# Altium schematic sheet Schematic.SchDoc
size A3; SheetNumber: 1; SheetTotal: 1
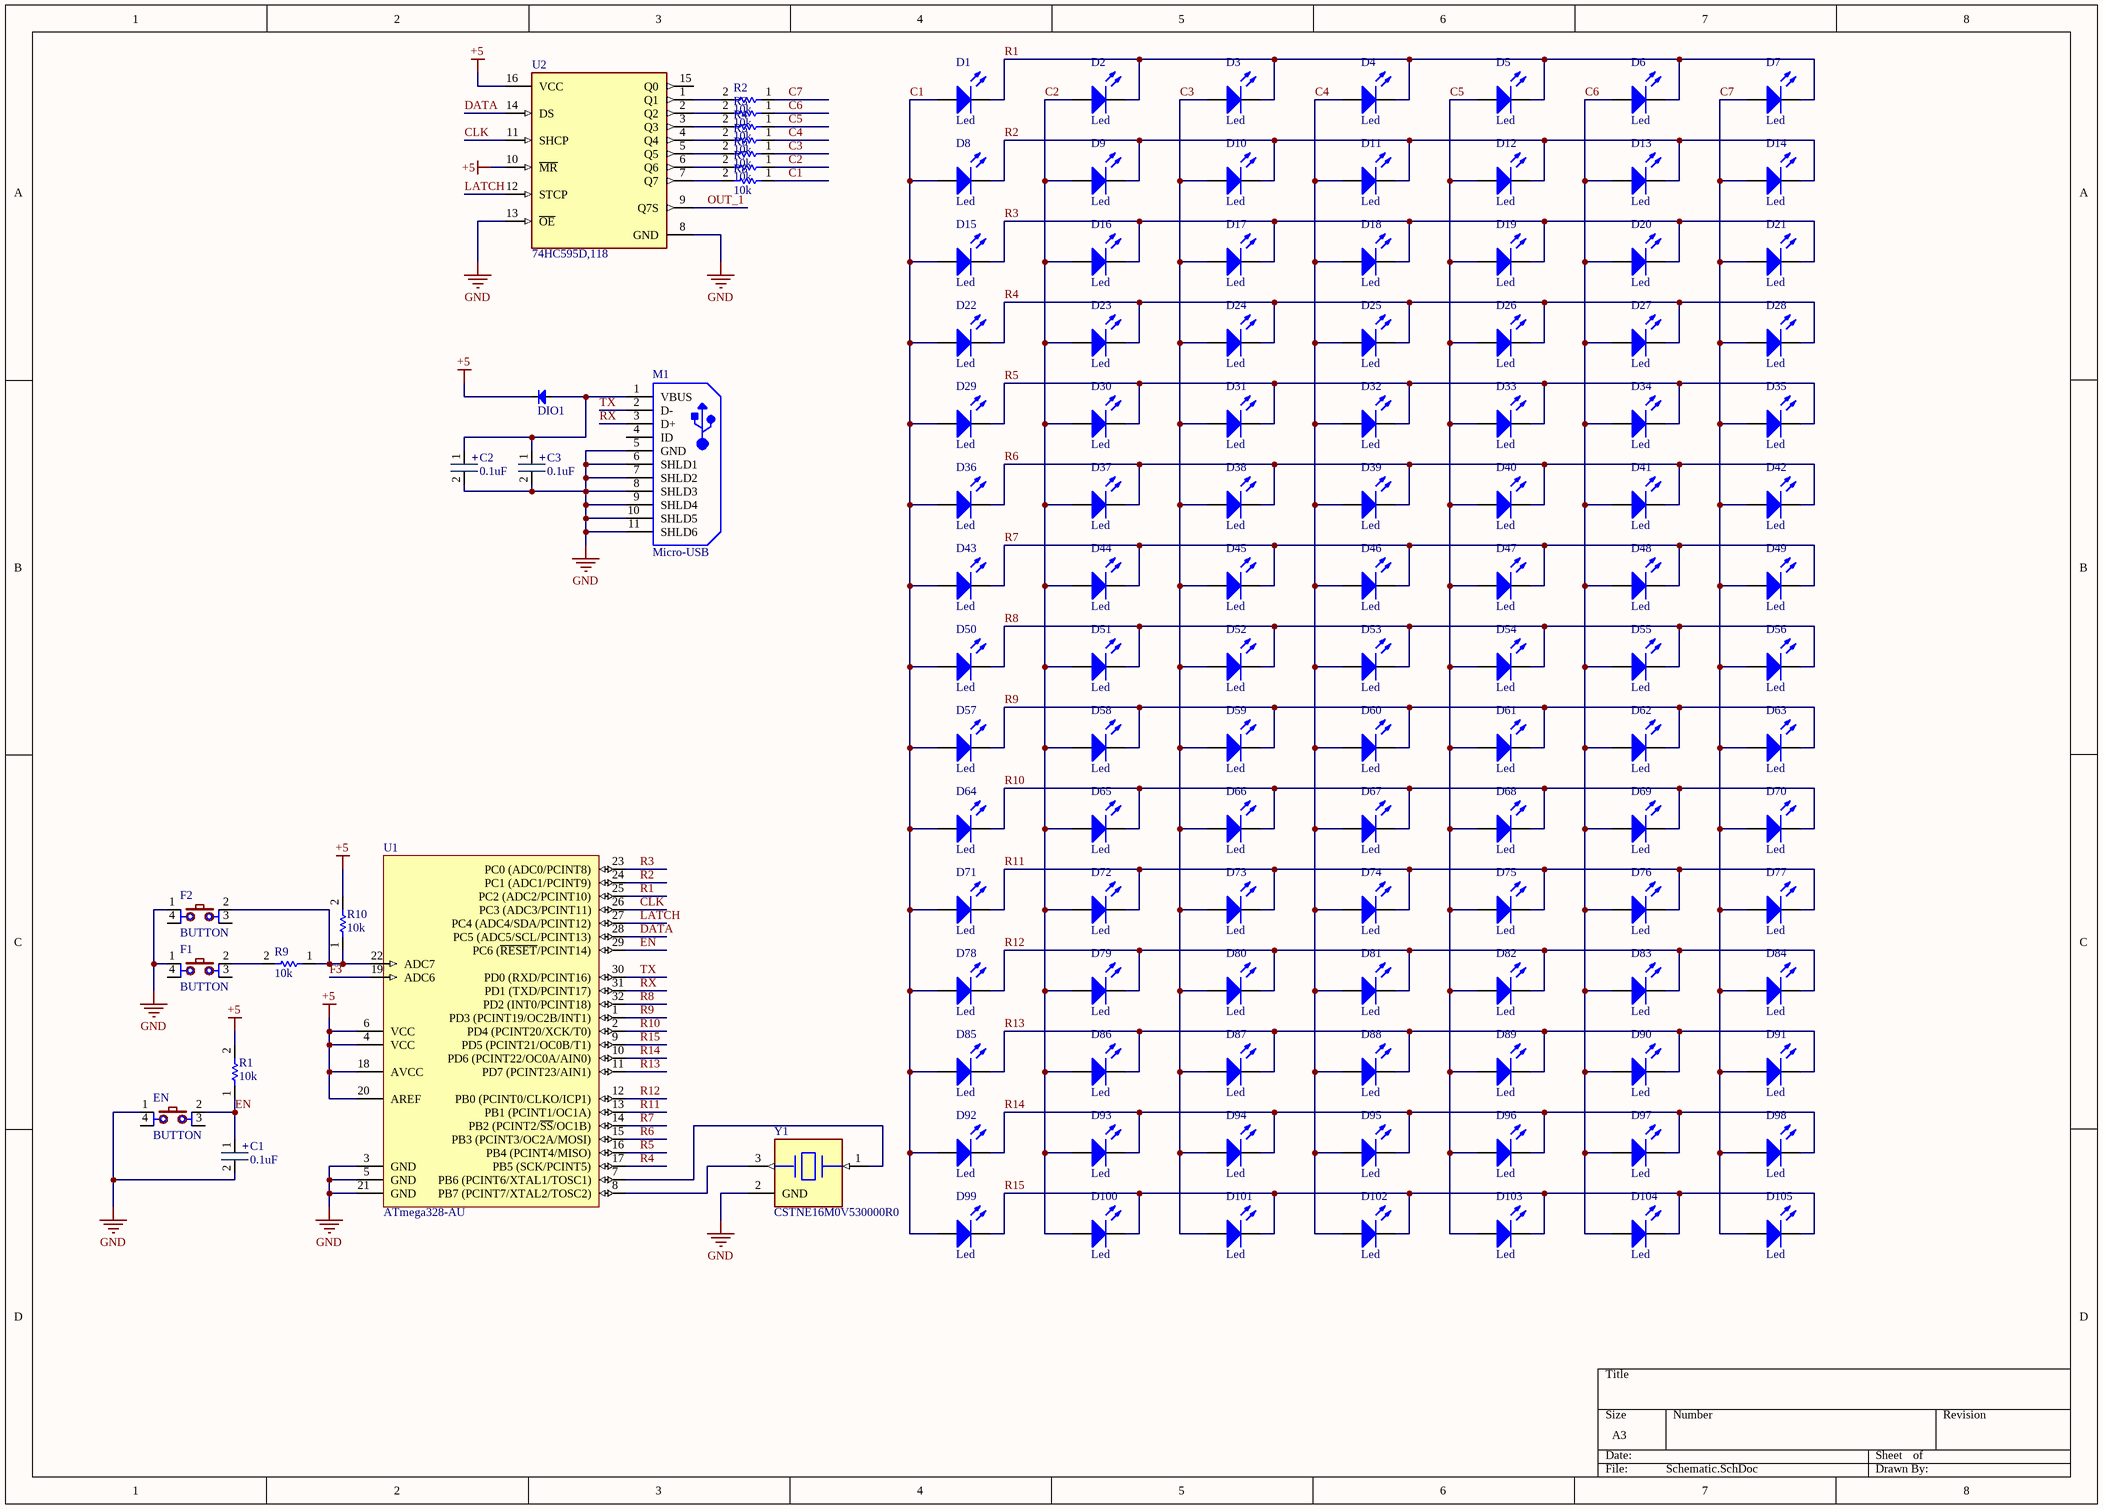
[diagram p0: Schematic.SchDoc]

## Parts
C1  0.1uF  [Cap_0603_A]
C2  0.1uF  [Cap_0603_A]
C3  0.1uF  [Cap_0603_A]
D1  Led  [LED 0603]
D2  Led  [LED 0603]
D3  Led  [LED 0603]
D4  Led  [LED 0603]
D5  Led  [LED 0603]
D6  Led  [LED 0603]
D7  Led  [LED 0603]
D8  Led  [LED 0603]
D9  Led  [LED 0603]
D10  Led  [LED 0603]
D11  Led  [LED 0603]
D12  Led  [LED 0603]
D13  Led  [LED 0603]
D14  Led  [LED 0603]
D15  Led  [LED 0603]
D16  Led  [LED 0603]
D17  Led  [LED 0603]
D18  Led  [LED 0603]
D19  Led  [LED 0603]
D20  Led  [LED 0603]
D21  Led  [LED 0603]
D22  Led  [LED 0603]
D23  Led  [LED 0603]
D24  Led  [LED 0603]
D25  Led  [LED 0603]
D26  Led  [LED 0603]
D27  Led  [LED 0603]
D28  Led  [LED 0603]
D29  Led  [LED 0603]
D30  Led  [LED 0603]
D31  Led  [LED 0603]
D32  Led  [LED 0603]
D33  Led  [LED 0603]
D34  Led  [LED 0603]
D35  Led  [LED 0603]
D36  Led  [LED 0603]
D37  Led  [LED 0603]
D38  Led  [LED 0603]
D39  Led  [LED 0603]
D40  Led  [LED 0603]
D41  Led  [LED 0603]
D42  Led  [LED 0603]
D43  Led  [LED 0603]
D44  Led  [LED 0603]
D45  Led  [LED 0603]
D46  Led  [LED 0603]
D47  Led  [LED 0603]
D48  Led  [LED 0603]
D49  Led  [LED 0603]
D50  Led  [LED 0603]
D51  Led  [LED 0603]
D52  Led  [LED 0603]
D53  Led  [LED 0603]
D54  Led  [LED 0603]
D55  Led  [LED 0603]
D56  Led  [LED 0603]
D57  Led  [LED 0603]
D58  Led  [LED 0603]
D59  Led  [LED 0603]
D60  Led  [LED 0603]
D61  Led  [LED 0603]
D62  Led  [LED 0603]
D63  Led  [LED 0603]
D64  Led  [LED 0603]
D65  Led  [LED 0603]
D66  Led  [LED 0603]
D67  Led  [LED 0603]
D68  Led  [LED 0603]
D69  Led  [LED 0603]
D70  Led  [LED 0603]
D71  Led  [LED 0603]
D72  Led  [LED 0603]
D73  Led  [LED 0603]
D74  Led  [LED 0603]
D75  Led  [LED 0603]
D76  Led  [LED 0603]
D77  Led  [LED 0603]
D78  Led  [LED 0603]
D79  Led  [LED 0603]
D80  Led  [LED 0603]
D81  Led  [LED 0603]
D82  Led  [LED 0603]
D83  Led  [LED 0603]
D84  Led  [LED 0603]
D85  Led  [LED 0603]
D86  Led  [LED 0603]
D87  Led  [LED 0603]
D88  Led  [LED 0603]
D89  Led  [LED 0603]
D90  Led  [LED 0603]
D91  Led  [LED 0603]
D92  Led  [LED 0603]
D93  Led  [LED 0603]
D94  Led  [LED 0603]
D95  Led  [LED 0603]
D96  Led  [LED 0603]
D97  Led  [LED 0603]
D98  Led  [LED 0603]
D99  Led  [LED 0603]
D100  Led  [LED 0603]
D101  Led  [LED 0603]
D102  Led  [LED 0603]
D103  Led  [LED 0603]
D104  Led  [LED 0603]
D105  Led  [LED 0603]
DIO1  Diode SMD  [DIO-SMD-106]  (value not drawn)
EN  BUTTON  [BUTTON 3x4mm 2 Pin]
F1  BUTTON  [BUTTON 3x4mm 2 Pin]
F2  BUTTON  [BUTTON 3x4mm 2 Pin]
M1  Micro-USB  [2.0 5 PIN SMD]
R1  10k  [Res_0603]
R2  10k  [Res_0603]
R3  10k  [Res_0603]
R4  10k  [Res_0603]
R5  10k  [Res_0603]
R6  10k  [Res_0603]
R7  10k  [Res_0603]
R8  10k  [Res_0603]
R9  10k  [Res_0603]
R10  10k  [Res_0603]
U1  ATmega328-AU  [TQFP32]
U2  74HC595D,118  [FP-SOT109-1-IPC_C]
Y1  CSTNE16M0V530000R0  [FP-CSTNE16M0V530000R0-MFG]

## Nets
+5: DIO1.2(K) R1.2 R10.2 U1.4(VCC) U1.6(VCC) U1.18(AVCC) U1.20(AREF) U2.10(~{MR}) U2.16(VCC)
GND: C1.2 C2.2 C3.2 EN.1 F1.1 F2.1 M1.5(GND) M1.6(SHLD1) M1.7(SHLD2) M1.8(SHLD3) M1.9(SHLD4) M1.10(SHLD5) M1.11(SHLD6) U1.3(GND) U1.5(GND) U1.21(GND) U2.8(GND) U2.13(~{OE}) Y1.2(GND)
C1: D1.1(A) D8.1(A) D15.1(A) D22.1(A) D29.1(A) D36.1(A) D43.1(A) D50.1(A) D57.1(A) D64.1(A) D71.1(A) D78.1(A) D85.1(A) D92.1(A) D99.1(A) R8.1
C2: D2.1(A) D9.1(A) D16.1(A) D23.1(A) D30.1(A) D37.1(A) D44.1(A) D51.1(A) D58.1(A) D65.1(A) D72.1(A) D79.1(A) D86.1(A) D93.1(A) D100.1(A) R7.1
C3: D3.1(A) D10.1(A) D17.1(A) D24.1(A) D31.1(A) D38.1(A) D45.1(A) D52.1(A) D59.1(A) D66.1(A) D73.1(A) D80.1(A) D87.1(A) D94.1(A) D101.1(A) R6.1
C4: D4.1(A) D11.1(A) D18.1(A) D25.1(A) D32.1(A) D39.1(A) D46.1(A) D53.1(A) D60.1(A) D67.1(A) D74.1(A) D81.1(A) D88.1(A) D95.1(A) D102.1(A) R5.1
C5: D5.1(A) D12.1(A) D19.1(A) D26.1(A) D33.1(A) D40.1(A) D47.1(A) D54.1(A) D61.1(A) D68.1(A) D75.1(A) D82.1(A) D89.1(A) D96.1(A) D103.1(A) R4.1
C6: D6.1(A) D13.1(A) D20.1(A) D27.1(A) D34.1(A) D41.1(A) D48.1(A) D55.1(A) D62.1(A) D69.1(A) D76.1(A) D83.1(A) D90.1(A) D97.1(A) D104.1(A) R3.1
C7: D7.1(A) D14.1(A) D21.1(A) D28.1(A) D35.1(A) D42.1(A) D49.1(A) D56.1(A) D63.1(A) D70.1(A) D77.1(A) D84.1(A) D91.1(A) D98.1(A) D105.1(A) R2.1
CLK: U1.26(PC3_(ADC3/PCINT11)) U2.11(SHCP)
DATA: U1.28(PC5_(ADC5/SCL/PCINT13)) U2.14(DS)
EN: C1.1 EN.2 R1.1 U1.29(PC6_(~{RESET}/PCINT14))
F3: U1.19(ADC6)
LATCH: U1.27(PC4_(ADC4/SDA/PCINT12)) U2.12(STCP)
OUT_1: U2.9(Q7S)
R1: D1.2(K) D2.2(K) D3.2(K) D4.2(K) D5.2(K) D6.2(K) D7.2(K) U1.25(PC2_(ADC2/PCINT10))
R2: D8.2(K) D9.2(K) D10.2(K) D11.2(K) D12.2(K) D13.2(K) D14.2(K) U1.24(PC1_(ADC1/PCINT9))
R3: D15.2(K) D16.2(K) D17.2(K) D18.2(K) D19.2(K) D20.2(K) D21.2(K) U1.23(PC0_(ADC0/PCINT8))
R4: D22.2(K) D23.2(K) D24.2(K) D25.2(K) D26.2(K) D27.2(K) D28.2(K) U1.17(PB5_(SCK/PCINT5))
R5: D29.2(K) D30.2(K) D31.2(K) D32.2(K) D33.2(K) D34.2(K) D35.2(K) U1.16(PB4_(PCINT4/MISO))
R6: D36.2(K) D37.2(K) D38.2(K) D39.2(K) D40.2(K) D41.2(K) D42.2(K) U1.15(PB3_(PCINT3/OC2A/MOSI))
R7: D43.2(K) D44.2(K) D45.2(K) D46.2(K) D47.2(K) D48.2(K) D49.2(K) U1.14(PB2_(PCINT2/~{SS}/OC1B))
R8: D50.2(K) D51.2(K) D52.2(K) D53.2(K) D54.2(K) D55.2(K) D56.2(K) U1.32(PD2_(INT0/PCINT18))
R9: D57.2(K) D58.2(K) D59.2(K) D60.2(K) D61.2(K) D62.2(K) D63.2(K) U1.1(PD3_(PCINT19/OC2B/INT1))
R10: D64.2(K) D65.2(K) D66.2(K) D67.2(K) D68.2(K) D69.2(K) D70.2(K) U1.2(PD4_(PCINT20/XCK/T0))
R11: D71.2(K) D72.2(K) D73.2(K) D74.2(K) D75.2(K) D76.2(K) D77.2(K) U1.13(PB1_(PCINT1/OC1A))
R12: D78.2(K) D79.2(K) D80.2(K) D81.2(K) D82.2(K) D83.2(K) D84.2(K) U1.12(PB0_(PCINT0/CLKO/ICP1))
R13: D85.2(K) D86.2(K) D87.2(K) D88.2(K) D89.2(K) D90.2(K) D91.2(K) U1.11(PD7_(PCINT23/AIN1))
R14: D92.2(K) D93.2(K) D94.2(K) D95.2(K) D96.2(K) D97.2(K) D98.2(K) U1.10(PD6_(PCINT22/OC0A/AIN0))
R15: D99.2(K) D100.2(K) D101.2(K) D102.2(K) D103.2(K) D104.2(K) D105.2(K) U1.9(PD5_(PCINT21/OC0B/T1))
RX: M1.3(D+) U1.31(PD1_(TXD/PCINT17))
TX: M1.2(D-) U1.30(PD0_(RXD/PCINT16))
NetC2_1: C2.1 C3.1 DIO1.1(A) M1.1(VBUS)
NetF1_2: F1.2 R9.2
NetF2_2: F2.2 R9.1 R10.1 U1.22(ADC7)
NetR2_2: R2.2 U2.1(Q1)
NetR3_2: R3.2 U2.2(Q2)
NetR4_2: R4.2 U2.3(Q3)
NetR5_2: R5.2 U2.4(Q4)
NetR6_2: R6.2 U2.5(Q5)
NetR7_2: R7.2 U2.6(Q6)
NetR8_2: R8.2 U2.7(Q7)
NetU1_7: U1.7(PB6_(PCINT6/XTAL1/TOSC1)) Y1.1(Input)
NetU1_8: U1.8(PB7_(PCINT7/XTAL2/TOSC2)) Y1.3(Output)

Not connected (* = marked no-connect by the designer): EN 3 4; F1 3 4; F2 3 4; M1 4(ID); U2 15(Q0)

## Notes on the sheet
- (in symbol Capacitor) +

## Library data of the parts
C1-C3 = Capacitor: General Purpose Ceramic Capacitor, 0603, 1nF, 10%, X7R, 15%, 50V; Case Code (Metric): 1608; Min Operating Temperature: -55°C; Weight: 7.1E-05oz; Series: -; Capacitance: 1nF; RoHS Compliant: Yes; Radiation Hardening: No; Height: 0.9mm; Mount: Surface Mount; REACH SVHC: No SVHC; Lead Free: Lead Free; Depth: 0.81mm; Voltage: 50V; Number of Pins: 2; Voltage Rating: 50V; Max Operating Temperature: 125°C; Termination: SMD/SMT; Construction: Flat; Case Code (Imperial): 0603; Dielectric: X7R; Width: 0.032inch; Tolerance: 10%; Case/Package: 0603; Contact Plating: Tin; Packaging: Tape and Reel; Voltage Rating (DC): 50V; Dielectric Material: Ceramic; Package Quantity: 4000; Thickness: 0.035inch; Length: 1.6mm
DIO1 = Diode SMD: Default Diode; Code - JEDEC: DO-214-AB; Value: 1N5007; Published: 8-Jun-2000; Revision: July-2002: Re-released for DXP Platform.; Publisher: Altium Limited
EN F1 F2 = BUTTON 4 PIN: Frequency: 100kHz; Low Level Output Current: 200mA; Quiescent Current: 15mA; Min Supply Voltage: 4.5V; Number of Timers/Counters: 1; Max Supply Voltage: 16V; Operating Supply Current: 10mA; High Level Output Current: -200mA; Packaging: Tape and Reel; Weight: 0.002561oz; REACH SVHC: No SVHC; Package Quantity: 2500; Width: 3.91mm; Max Operating Temperature: 70°C; Contact Plating: Gold; Lead Free: Lead Free; Number of Pins: 8; Min Operating Temperature: 0°C; Radiation Hardening: No; Length: 4.9mm; Case/Package: SOIC; Height: 1.58mm; Mount: Surface Mount
R1-R10 = Resistor
U1 = ATmega328-AU: 8-bit AVR Microcontroller, 32KB Flash, 1KB EEPROM, 2KB SRAM, 32-pin TQFP, Industrial Grade (-40°C to 85°C); Published: 1-Apr-2010; DatasheetVersion: revA, Jan-2010; PackageVersion: revB, Oct-2001; PackageReference: 32A; Publisher: Altium Limited; PackageDescription: 32-Lead, 7x7x1.0 mm Body, 0.8mm Lead Pitch, Thin Profile Plastic Quad Flat Package (TQFP); Supplier 1: Digi-Key; Supplier Part Number 1: ATMEGA328-AU-ND; Supplier 2: Mouser; Supplier Part Number 2: 556-ATMEGA328-AU; Code_JEDEC: MS-026-ABA; ComponentLink1Description: Manufacturer Link; ComponentLink1URL: http://www.atmel.com/products/avr/default.asp?; ComponentLink2Description: ATmega48A/48PA/88A/88PA/168A/168PA/328/328P Datasheet; ComponentLink2URL: http://www.atmel.com/dyn/resources/prod_documents/8271.pdf; ComponentLink3Description: ATmega48A/48PA/88A/88PA/168A/168PA/328/328P Summary; ComponentLink3URL: http://www.atmel.com/dyn/resources/prod_documents/8271S.pdf; ComponentLink4Description: Atmel.com Home; ComponentLink4URL: http://www.atmel.com
U2 = CMP-14351-000006-1: IC SHIFT REGISTER 8BIT 16SOIC; RoHS Compliant: Yes
Y1 = CMP-06054-000001-1: CERAMIC RES 16.0000MHZ 15PF SMD; Manufacturer: Murata; Tolerance: 0.5%; Stability: 0.3%; Frequency: 16MHz; Esr: 40Ω; Lead Free: Yes; ComponentLink2URL: https://www.murata.com/en-sg/products/productdata/8801162231838/SPEC-CSTNE16M0V530000R0.pdf?1545967809000; ComponentLink2Description: Datasheet; Device Class L3: Crystals; Load Capacitance: 15pF; Temperature: -40°C to +85°C; Temperature Range High: +85°C; Series: CSTNE_V; Mouser Description: Ceramic Resonator 16MHz ±0.5% (Tol) ±0.3% (Stability) 15pF 40Ohm 3-Pin CSMD T/R; Automotive: No; RoHS: TRUE; Device Class L2: Crystals / Oscillators; Manufacturer Part Number: CSTNE16M0V530000R0; Package: 0; Category: Crys; Device Class L1: Passive Components; Height: 1mm; Temperature Range Low: -40°C; Digikey Description: CERAMIC RES 16.0000MHZ 15PF SMD; Octopart: https://octopart.com/cstne16m0v530000r0-murata-91406924